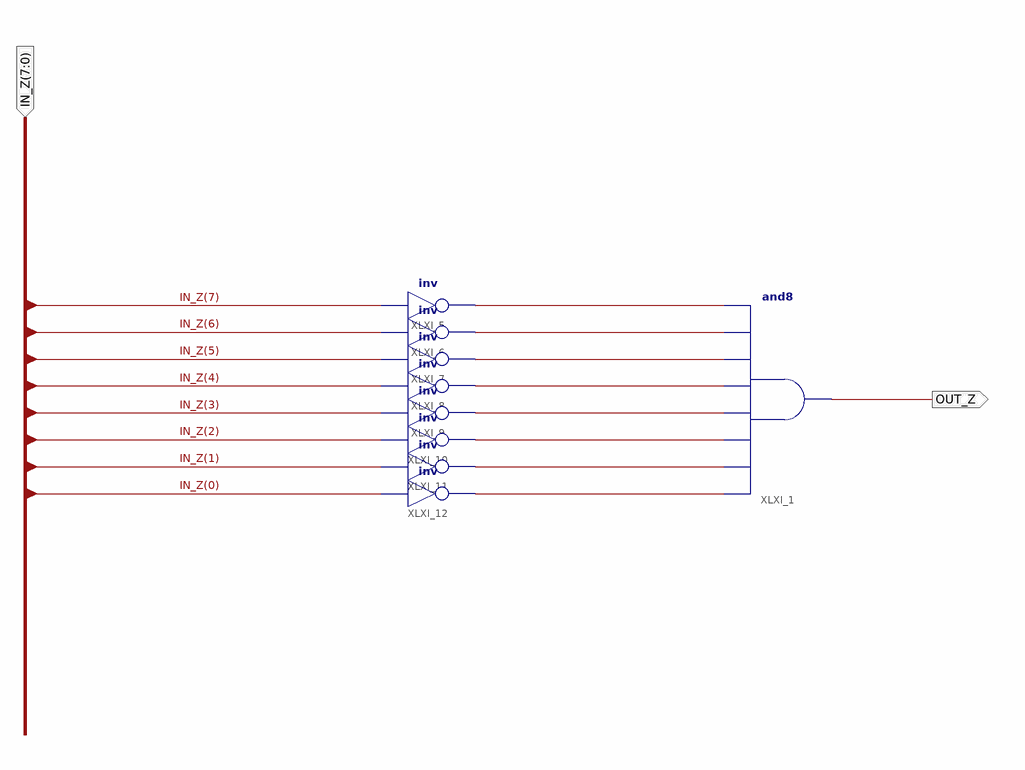
[diagram p0: schematic sheet 1]
// Xilinx ISE schematic Z.sch (spartan3e) as structural Verilog: 9 symbols, 2 ports
module Z (
  input  [7:0] IN_Z,
  output OUT_Z
);

  wire XLXN_16, XLXN_17, XLXN_18, XLXN_19, XLXN_20, XLXN_21, XLXN_22, XLXN_24;

  and XLXI_1 (OUT_Z, XLXN_24, XLXN_22, XLXN_21, XLXN_20, XLXN_19, XLXN_18, XLXN_17, XLXN_16);
  not XLXI_5 (XLXN_16, IN_Z[7]);
  not XLXI_6 (XLXN_17, IN_Z[6]);
  not XLXI_7 (XLXN_18, IN_Z[5]);
  not XLXI_8 (XLXN_19, IN_Z[4]);
  not XLXI_9 (XLXN_20, IN_Z[3]);
  not XLXI_10 (XLXN_21, IN_Z[2]);
  not XLXI_11 (XLXN_22, IN_Z[1]);
  not XLXI_12 (XLXN_24, IN_Z[0]);
endmodule
